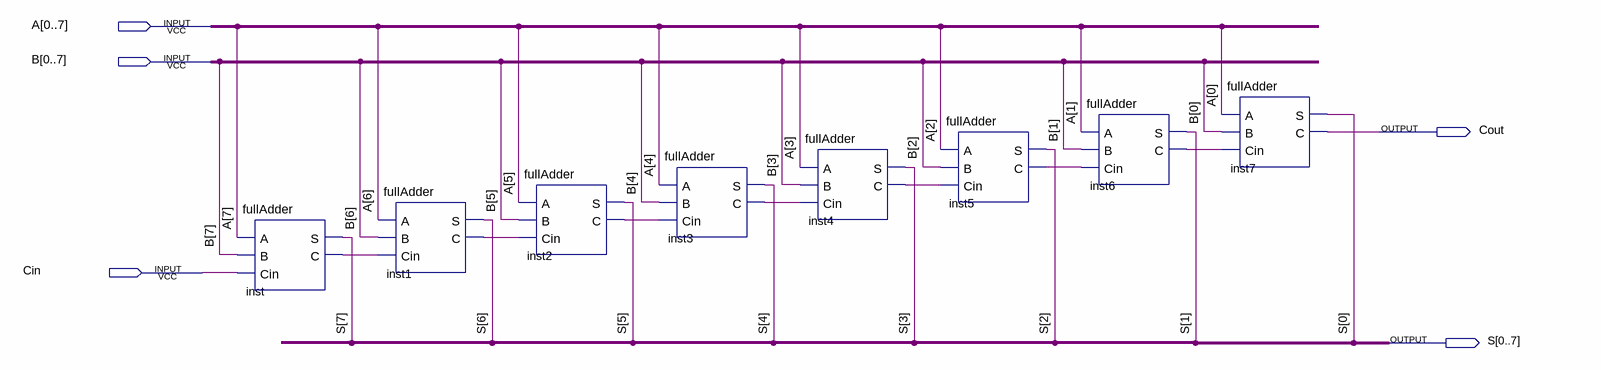
[diagram p0: schematic sheet]
// Quartus schematic EightBitAdder.bdf as structural Verilog: 8 symbols, 5 pins
module EightBitAdder (
  input  [0:7] A,
  input  [0:7] B,
  input  Cin,
  output Cout,
  output [0:7] S
);

  wire inst1_c, inst2_c, inst3_c, inst4_c, inst5_c, inst6_c, inst_c;

  fullAdder inst (.A(A[7]), .B(B[7]), .Cin(Cin), .S(S[7]), .C(inst_c));
  fullAdder inst1 (.A(A[6]), .B(B[6]), .Cin(inst_c), .S(S[6]), .C(inst1_c));
  fullAdder inst2 (.A(A[5]), .B(B[5]), .Cin(inst1_c), .S(S[5]), .C(inst2_c));
  fullAdder inst3 (.A(A[4]), .B(B[4]), .Cin(inst2_c), .S(S[4]), .C(inst3_c));
  fullAdder inst4 (.A(A[3]), .B(B[3]), .Cin(inst3_c), .S(S[3]), .C(inst4_c));
  fullAdder inst5 (.A(A[2]), .B(B[2]), .Cin(inst4_c), .S(S[2]), .C(inst5_c));
  fullAdder inst6 (.A(A[1]), .B(B[1]), .Cin(inst5_c), .S(S[1]), .C(inst6_c));
  fullAdder inst7 (.A(A[0]), .B(B[0]), .Cin(inst6_c), .S(S[0]), .C(Cout));
endmodule
